# EAGLE design grbl_pendant (EAGLE 6.6.0)

## Sheet 1 of 2
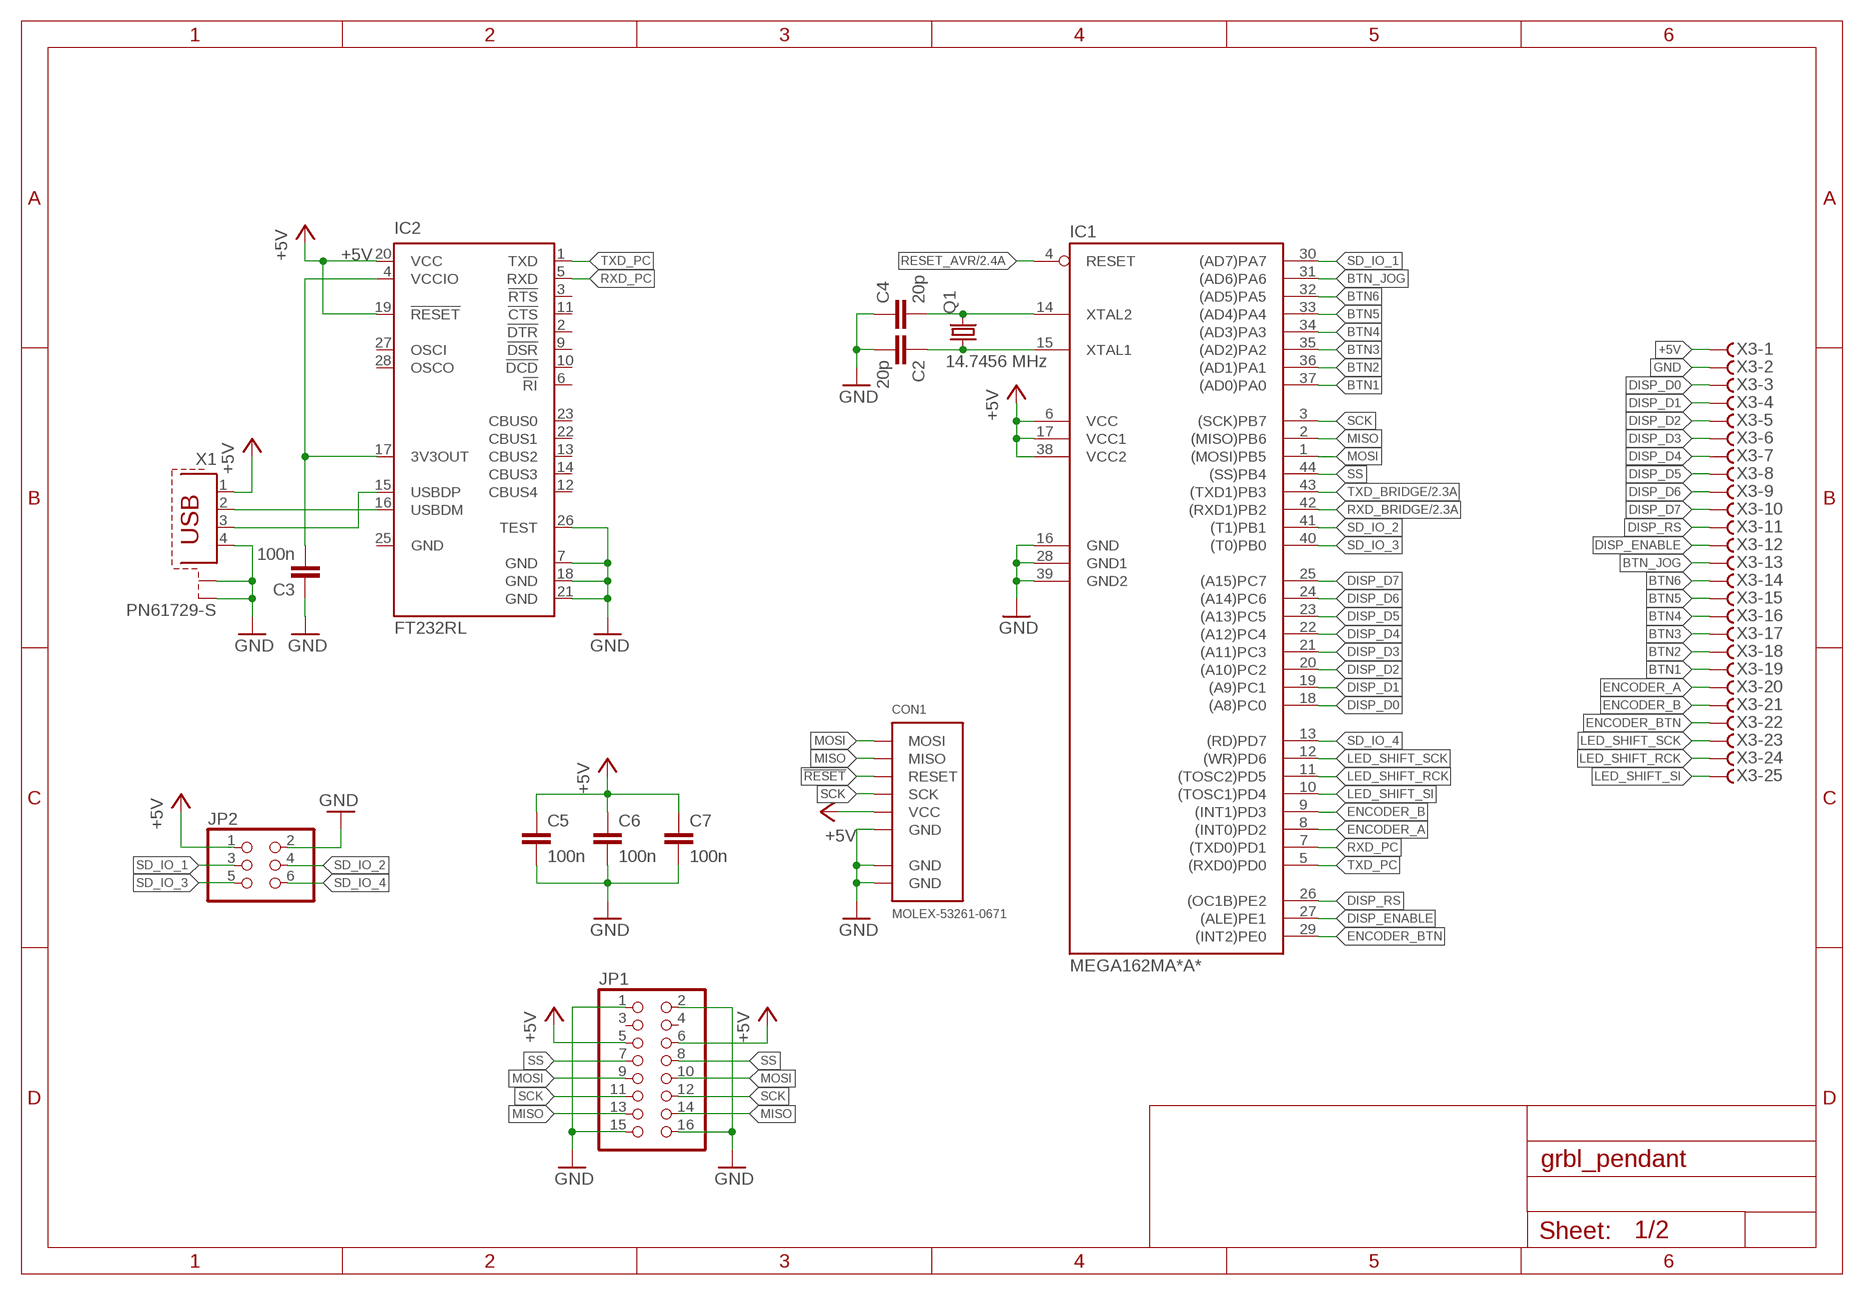
[diagram p0: schematic, sheet 1]

### Parts
C2  20p  C-EUC0603K  [C0603K]
C3  100n  C-EUC0603  [C0603]
C4  20p  C-EUC0603K  [C0603K]
C5  100n  C-EUC0603K  [C0603K]
C6  100n  C-EUC0603K  [C0603K]
C7  100n  C-EUC0603K  [C0603K]
CON1  MOLEX-53261-0671  [MOLEX-53261-0671]
IC1  MEGA162MA*A*  [TQFP44]
IC2  FT232RL  [SSOP28]
JP1  PINHD-2X08_2.54  [2X08]
JP2  PINHD-2X03_2.54  [2X03]
Q1  14.7456 MHz  CRYSTALHC49UP  [HC49UP]
X1  PN61729-S  [PN61729-S]
X3  F25HPS  [F25HP]

### Nets
!RESET: CON1.3(RESET)
+5V: C5.1 C6.1 C7.1 CON1.5(VCC) IC1.6(VCC) IC1.17(VCC1) IC1.38(VCC2) IC2.19(!RESET) IC2.20(VCC) JP1.5 JP1.6 JP2.1 X1.1 X3.1 ; also sheet 2
BTN1: IC1.37((AD0)PA0) X3.19
BTN2: IC1.36((AD1)PA1) X3.18
BTN3: IC1.35((AD2)PA2) X3.17
BTN4: IC1.34((AD3)PA3) X3.16
BTN5: IC1.33((AD4)PA4) X3.15
BTN6: IC1.32((AD5)PA5) X3.14
BTN_JOG: IC1.31((AD6)PA6) X3.13
DISP_D0: IC1.18((A8)PC0) X3.3
DISP_D1: IC1.19((A9)PC1) X3.4
DISP_D2: IC1.20((A10)PC2) X3.5
DISP_D3: IC1.21((A11)PC3) X3.6
DISP_D4: IC1.22((A12)PC4) X3.7
DISP_D5: IC1.23((A13)PC5) X3.8
DISP_D6: IC1.24((A14)PC6) X3.9
DISP_D7: IC1.25((A15)PC7) X3.10
DISP_ENABLE: IC1.27((ALE)PE1) X3.12
DISP_RS: IC1.26((OC1B)PE2) X3.11
ENCODER_A: IC1.8((INT0)PD2) X3.20
ENCODER_B: IC1.9((INT1)PD3) X3.21
ENCODER_BTN: IC1.29((INT2)PE0) X3.22
GND: C2.2 C3.1 C4.1 C5.2 C6.2 C7.2 CON1.6(GND) CON1.GND@1(GND) CON1.GND@2(GND) IC1.16(GND) IC1.28(GND1) IC1.39(GND2) IC2.7(GND) IC2.18(GND) IC2.21(GND) IC2.26(TEST) JP1.1 JP1.2 JP1.15 JP1.16 JP2.2 X1.4 X1.S1 X1.S2 X3.2 ; also sheet 2
LED_SHIFT_RCK: IC1.11((TOSC2)PD5) X3.24
LED_SHIFT_SCK: IC1.12((WR)PD6) X3.23
LED_SHIFT_SI: IC1.10((TOSC1)PD4) X3.25
MISO: CON1.2(MISO) IC1.2((MISO)PB6) JP1.13 JP1.14
MOSI: CON1.1(MOSI) IC1.1((MOSI)PB5) JP1.9 JP1.10
N$5: C3.2 IC2.4(VCCIO) IC2.17(3V3OUT)
N$7: C4.2 IC1.14(XTAL2) Q1.2
N$8: C2.1 IC1.15(XTAL1) Q1.1
RESET_AVR: IC1.4(RESET) ; also sheet 2
RXD_BRIDGE: IC1.42((RXD1)PB2) ; also sheet 2
RXD_PC: IC1.7((TXD0)PD1) IC2.5(RXD)
SCK: CON1.4(SCK) IC1.3((SCK)PB7) JP1.11 JP1.12
SD_IO_1: IC1.30((AD7)PA7) JP2.3
SD_IO_2: IC1.41((T1)PB1) JP2.4
SD_IO_3: IC1.40((T0)PB0) JP2.5
SD_IO_4: IC1.13((RD)PD7) JP2.6
SS: IC1.44((SS)PB4) JP1.7 JP1.8
TXD_BRIDGE: IC1.43((TXD1)PB3) ; also sheet 2
TXD_PC: IC1.5((RXD0)PD0) IC2.1(TXD)
USBDM: IC2.16(USBDM) X1.2
USBDP: IC2.15(USBDP) X1.3
Unconnected: IC2.2(!DTR) IC2.3(!RTS) IC2.6(!RI) IC2.9(!DSR) IC2.10(!DCD) IC2.11(!CTS) IC2.12(CBUS4) IC2.13(CBUS2) IC2.14(CBUS3) IC2.22(CBUS1) IC2.23(CBUS0) IC2.27(OSCI) IC2.28(OSCO) JP1.3 JP1.4

## Sheet 2 of 2
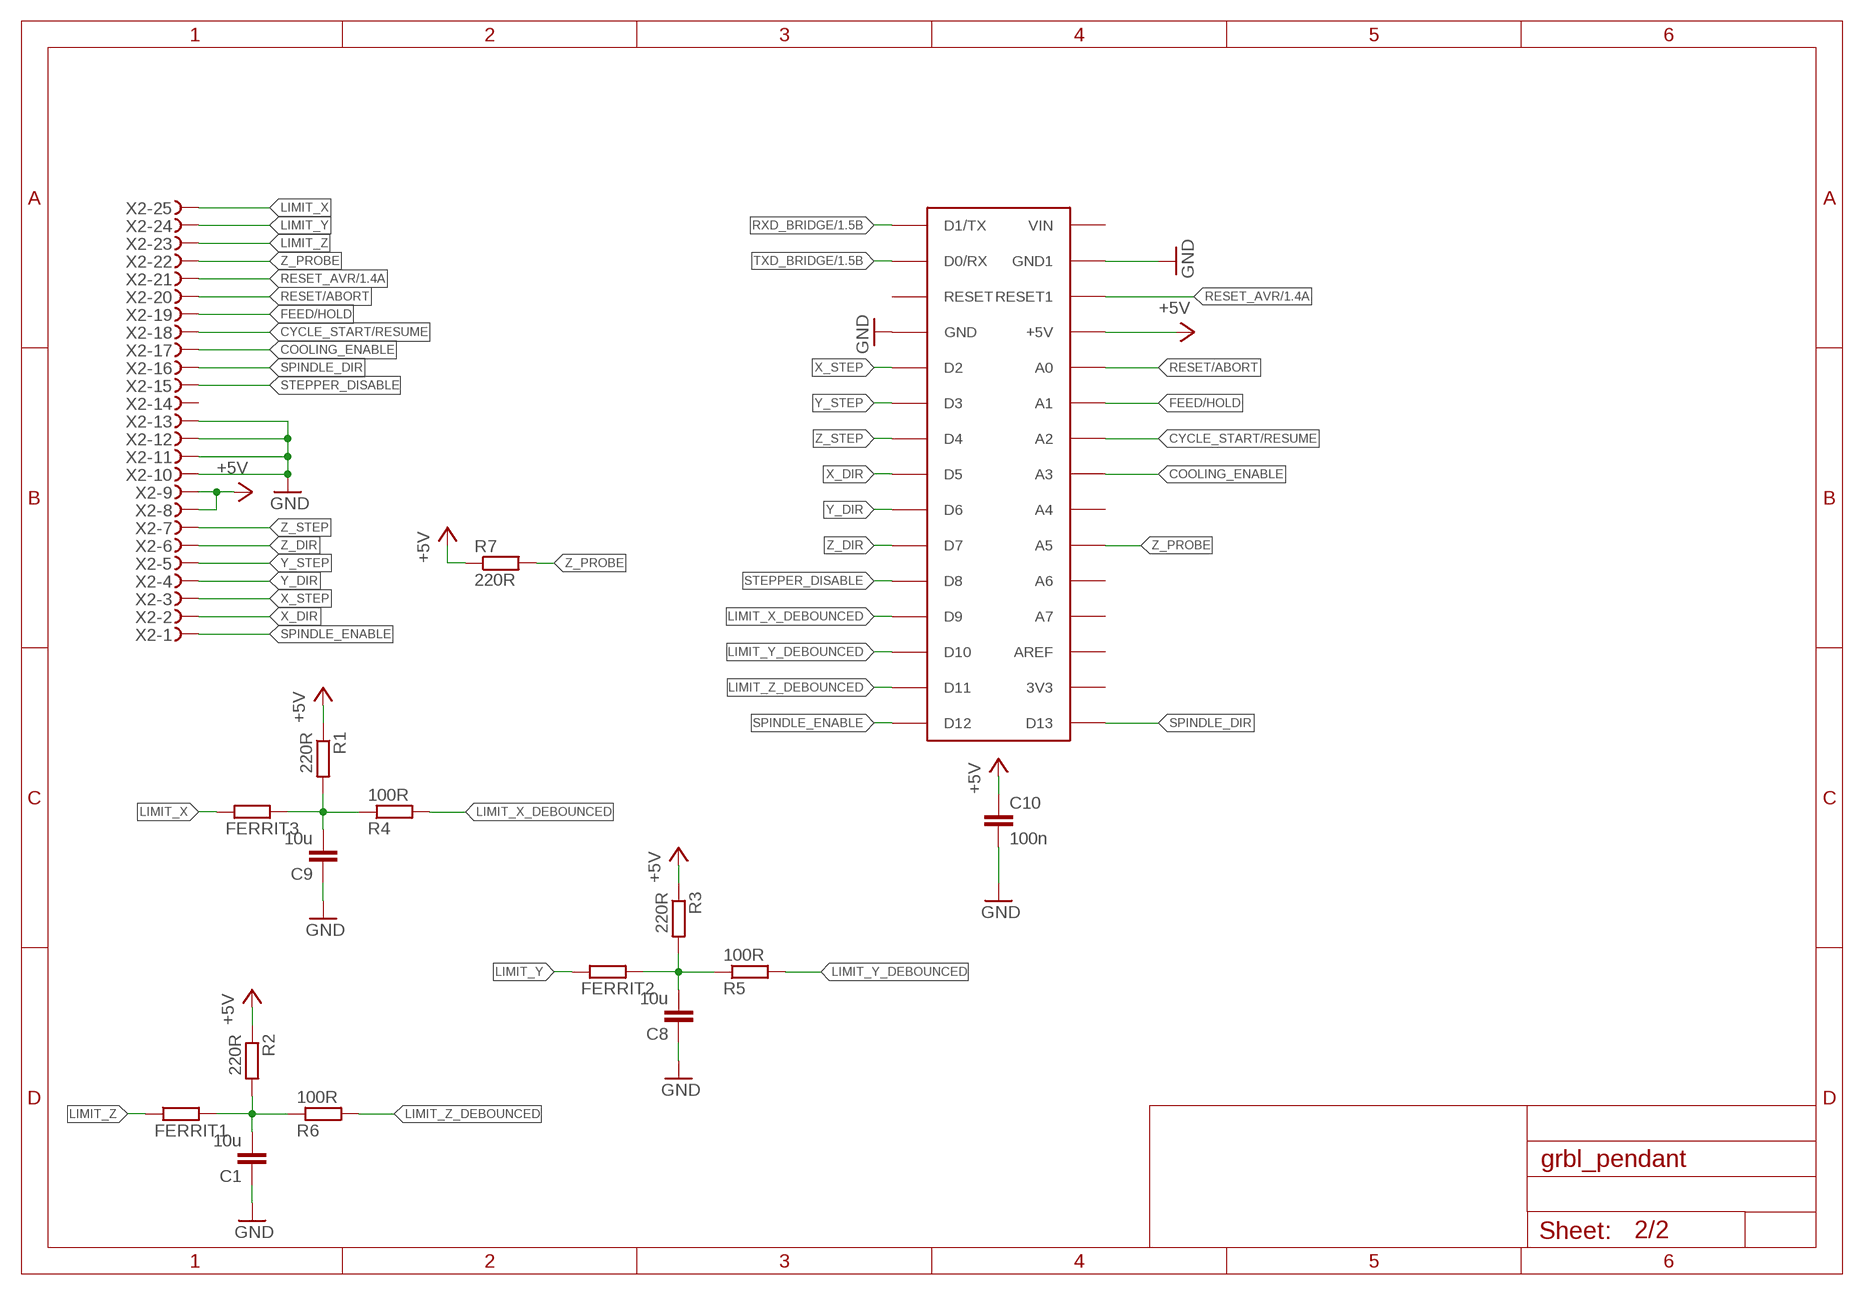
[diagram p1: schematic, sheet 2]

### Parts
C1  10u  C-EUC0805  [C0805]
C8  10u  C-EUC0805  [C0805]
C9  10u  C-EUC0805  [C0805]
C10  100n  C-EUC0805  [C0805]
FERRIT1  R-EU_M0805  [M0805]
FERRIT2  R-EU_M0805  [M0805]
FERRIT3  R-EU_M0805  [M0805]
R1  220R  R-EU_R0603  [R0603]
R2  220R  R-EU_R0603  [R0603]
R3  220R  R-EU_R0603  [R0603]
R4  100R  R-EU_R0603  [R0603]
R5  100R  R-EU_R0603  [R0603]
R6  100R  R-EU_R0603  [R0603]
R7  220R  R-EU_R0603  [R0603]
U$2  ARDUINONANO  [PDIP-32]
X2  F25HPS  [F25HP]

### Nets
+5V: C10.1 R1.1 R2.1 R3.1 R7.1 U$2.+5V X2.8 X2.9 ; also sheet 1
COOLING_ENABLE: U$2.A3 X2.17
CYCLE_START/RESUME: U$2.A2 X2.18
FEED/HOLD: U$2.A1 X2.19
GND: C1.1 C8.1 C9.1 C10.2 U$2.GND U$2.GND1 X2.10 X2.11 X2.12 X2.13 ; also sheet 1
LIMIT_INT_X: C9.2 FERRIT3.2 R1.2 R4.1
LIMIT_INT_Y: C8.2 FERRIT2.2 R3.2 R5.1
LIMIT_INT_Z: C1.2 FERRIT1.2 R2.2 R6.1
LIMIT_X: FERRIT3.1 X2.25
LIMIT_X_DEBOUNCED: R4.2 U$2.D9
LIMIT_Y: FERRIT2.1 X2.24
LIMIT_Y_DEBOUNCED: R5.2 U$2.D10
LIMIT_Z: FERRIT1.1 X2.23
LIMIT_Z_DEBOUNCED: R6.2 U$2.D11
RESET/ABORT: U$2.A0 X2.20
RESET_AVR: U$2.RESET1 X2.21 ; also sheet 1
RXD_BRIDGE: U$2.D1/TX ; also sheet 1
SPINDLE_DIR: U$2.D13 X2.16
SPINDLE_ENABLE: U$2.D12 X2.1
STEPPER_DISABLE: U$2.D8 X2.15
TXD_BRIDGE: U$2.D0/RX ; also sheet 1
X_DIR: U$2.D5 X2.2
X_STEP: U$2.D2 X2.3
Y_DIR: U$2.D6 X2.4
Y_STEP: U$2.D3 X2.5
Z_DIR: U$2.D7 X2.6
Z_PROBE: R7.2 U$2.A5 X2.22
Z_STEP: U$2.D4 X2.7
Unconnected: U$2.3V3 U$2.A4 U$2.A6 U$2.A7 U$2.AREF U$2.RESET U$2.VIN X2.14

## Power pins joined to a net without a drawn wire
GND: IC2.25(GND)

## Library data of the parts
C1-C10 = rcl:C-EU: CAPACITOR, European symbol
CON1 = SchlegelAr_Master:MOLEX-53261-0671: MOLEX-53261-0671 - Molex picoblade 53261-0671 6 pol last modified: Armin Schlegel, 28.04.2014 http://de.mouser.com/ProductDetail/Molex/53261-0671/?qs=%2Fha2pyFadujL8XqTNrjzA%2Fy0AZso5hx2IWE7X8dEAdsn1tpb%2FKahAA%3D%3D http://www.mouser.com/ds/2/276/0532610671_PCB_HEADERS-170915.pdf
FERRIT1-FERRIT3 R1-R7 = rcl:R-EU_: RESISTOR, European symbol
IC1 = avr-7:MEGA162*MA: Atmel Mega162 TQFP and MLF packages
IC2 = ftdichip:FT232R: Source: http://www.ftdichip.com/Documents/DataSheets/DS_FT232R_v104.pdf; MPN: FT232RL; OC_FARNELL: 1146032; OC_NEWARK: 91K9918
JP1 = pinhead-2:PINHD-2X08: PIN HEADER
JP2 = pinhead-2:PINHD-2X03: PIN HEADER
Q1 = crystal:CRYSTAL: CRYSTAL; OC_FARNELL: unknown; OC_NEWARK: unknown
U$2 = rocketfarm:ARDUINONANO
X1 = con-berg:PN61729-S: BERG USB connector; OC_FARNELL: unknown; OC_NEWARK: unknown
X2 X3 = con-subd:F25?S: SUB-D; OC_FARNELL: unknown; OC_NEWARK: unknown

## Board
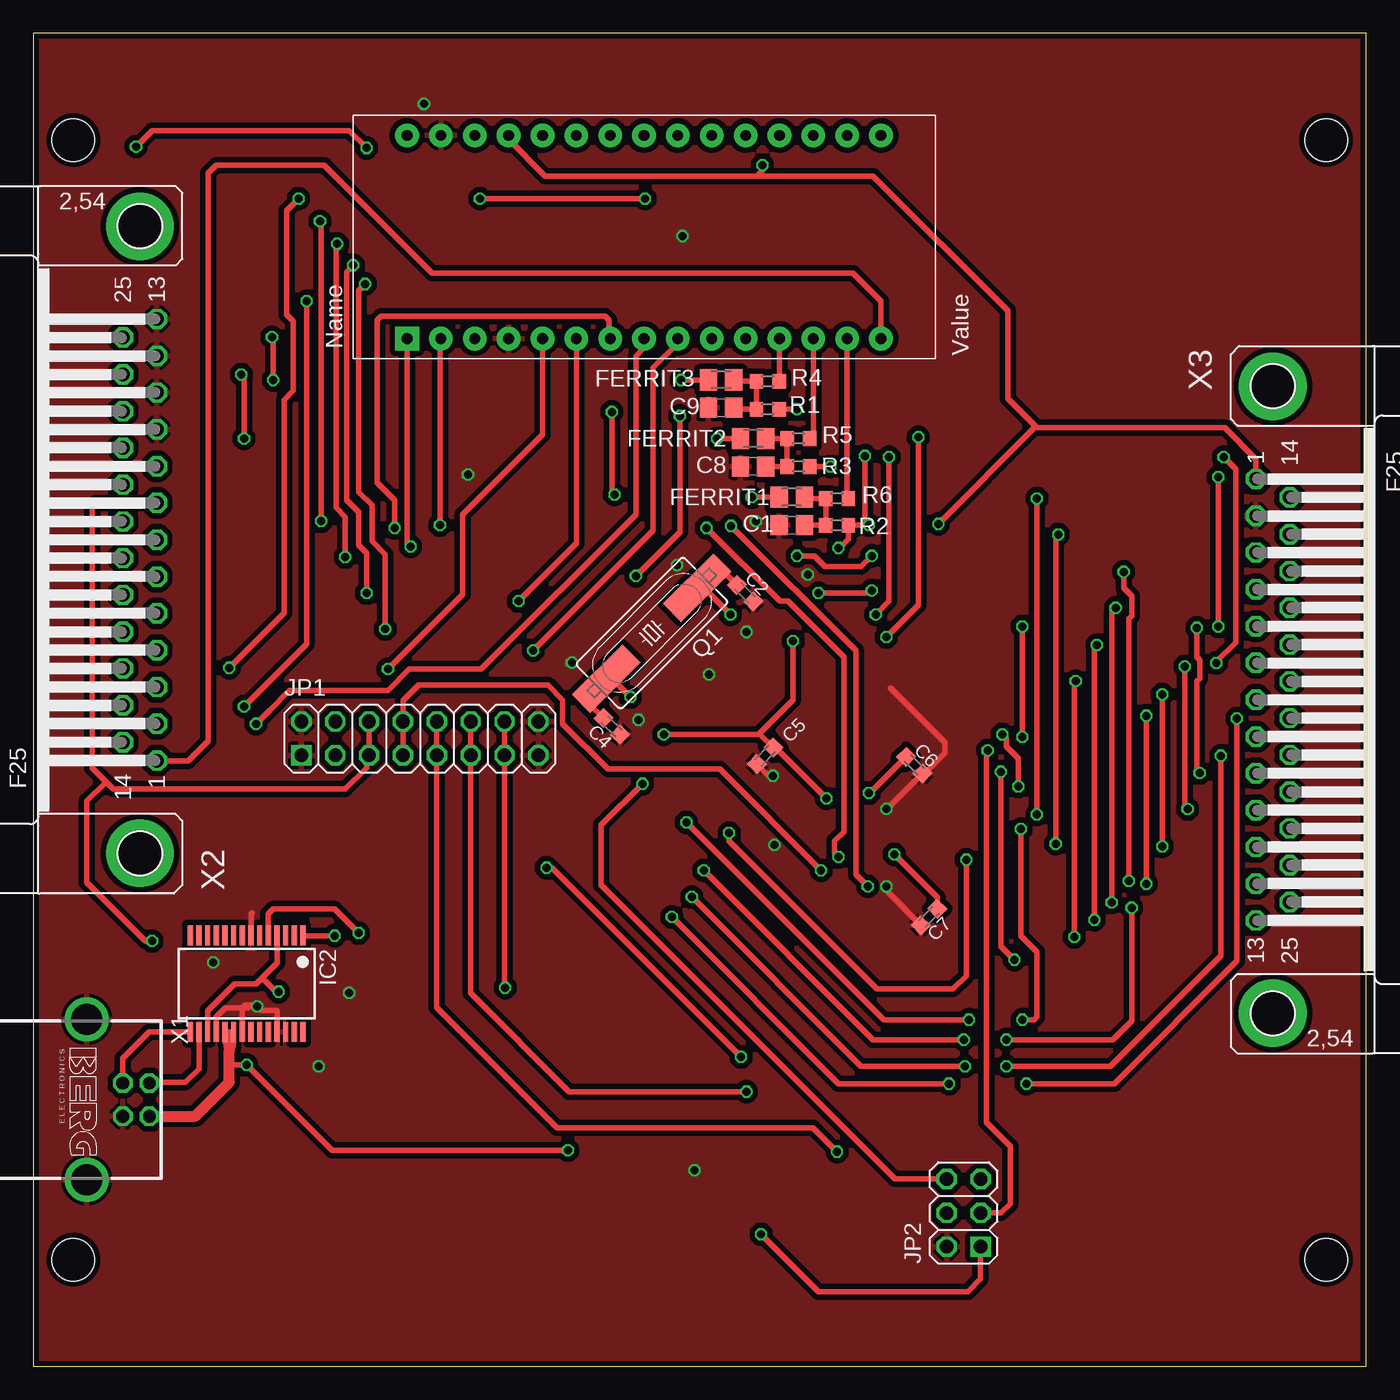
[diagram p2: board, top side]
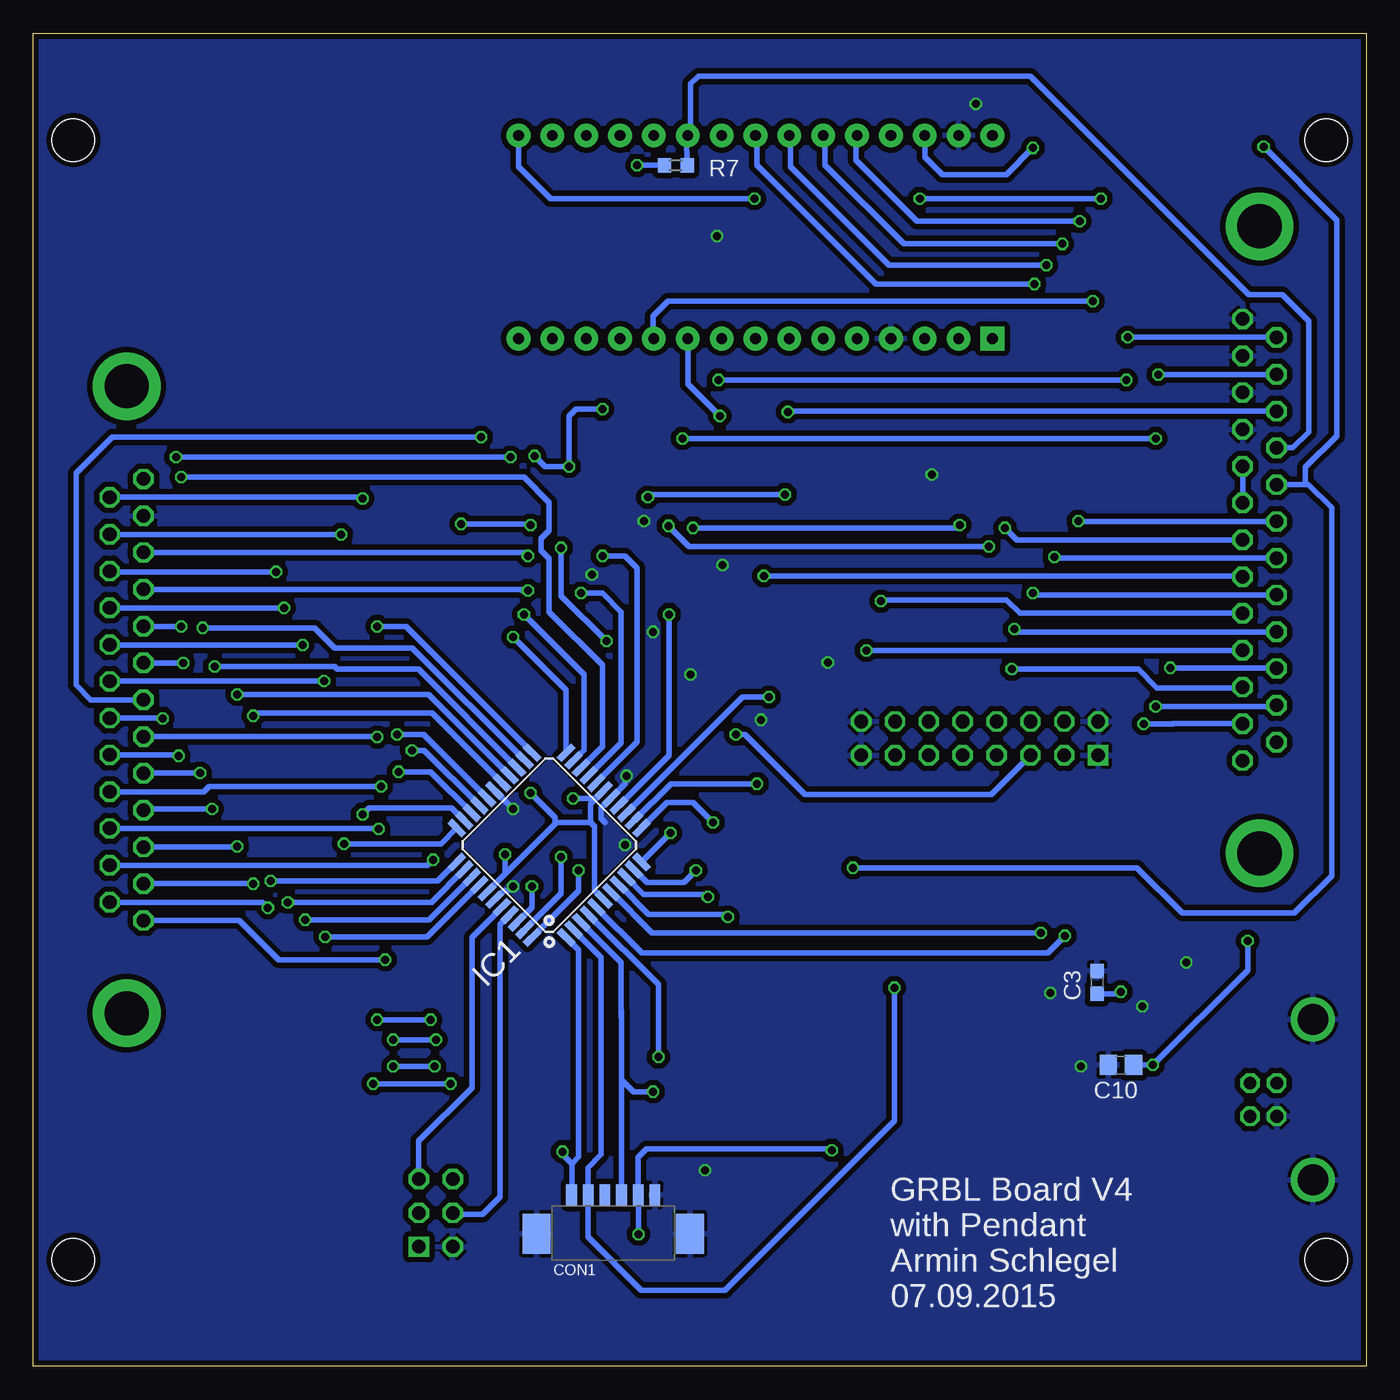
[diagram p3: board, bottom side, seen from below]

Size 100 x 100 mm. Coordinates in mm from the lower left corner, seen from the top.
Outline: 0,0 100,0 100,100 0,100 0,0
Copper layers (1*16): Top 0.035mm / dielectric 1.5mm / Bottom 0.035mm
Design rules "Elecrow_2-layer_eagle_rule": minimum track width 6mil, minimum drill 12mil, track to track 6mil, track to pad 6mil, pad to pad 6mil, via to via 6mil, smd to smd 0mil, copper to edge 10mil, drill to drill 10mil, minimum pad ring 10mil, minimum via ring 6mil, stop-mask expansion 2mil, vias tented up to drill 100mil, thermal gap 10mil
Holes 3.2 mm at 3,92 3,8 97,8 97,92

### Footprints (pad centres in the part's own frame; a part is rotated, then mirrored left to right if it is on the bottom)
C0805 = smd 1.3 x 1.5: 1 -0.95,0; 2 0.95,0
C0603K = smd 1.05 x 1.08: 1 -0.875,0; 2 0.875,0
C0603 = smd 1.1 x 1: 1 -0.85,0; 2 0.85,0
MOLEX-53261-0671 = smd 0.8 x 1.6: 1 -3.125,2.55; 2 -1.875,2.55; 3 -0.625,2.55; 4 0.625,2.55; 5 1.875,2.55; 6 3.125,2.55 | smd 2.1 x 3: GND@1 -5.75,-0.35; GND@2 5.75,-0.35
M0805 = smd 1.3 x 1.6: 1 -0.95,0; 2 0.95,0
TQFP44 = smd 1.5 x 0.5: 1 -5.8,4; 2 -5.8,3.2; 3 -5.8,2.4; 4 -5.8,1.6; 5 -5.8,0.8; 6 -5.8,0; 7 -5.8,-0.8; 8 -5.8,-1.6; 9 -5.8,-2.4; 10 -5.8,-3.2; 11 -5.8,-4; 23 5.8,-4; 24 5.8,-3.2; 25 5.8,-2.4; 26 5.8,-1.6; 27 5.8,-0.8; 28 5.8,0; 29 5.8,0.8; 30 5.8,1.6; 31 5.8,2.4; 32 5.8,3.2; 33 5.8,4 | smd 0.5 x 1.5: 12 -4,-5.8; 13 -3.2,-5.8; 14 -2.4,-5.8; 15 -1.6,-5.8; 16 -0.8,-5.8; 17 0,-5.8; 18 0.8,-5.8; 19 1.6,-5.8; 20 2.4,-5.8; 21 3.2,-5.8; 22 4,-5.8; 34 4,5.8; 35 3.2,5.8; 36 2.4,5.8; 37 1.6,5.8; 38 0.8,5.8; 39 0,5.8; 40 -0.8,5.8; 41 -1.6,5.8; 42 -2.4,5.8; 43 -3.2,5.8; 44 -4,5.8
SSOP28 = smd 0.4 x 1.5: 1 -4.225,-3.625; 2 -3.575,-3.625; 3 -2.925,-3.625; 4 -2.275,-3.625; 5 -1.625,-3.625; 6 -0.975,-3.625; 7 -0.325,-3.625; 8 0.325,-3.625; 9 0.975,-3.625; 10 1.625,-3.625; 11 2.275,-3.625; 12 2.925,-3.625; 13 3.575,-3.625; 14 4.225,-3.625; 15 4.225,3.625; 16 3.575,3.625; 17 2.925,3.625; 18 2.275,3.625; 19 1.625,3.625; 20 0.975,3.625; 21 0.325,3.625; 22 -0.325,3.625; 23 -0.975,3.625; 24 -1.625,3.625; 25 -2.275,3.625; 26 -2.925,3.625; 27 -3.575,3.625; 28 -4.225,3.625
2X08 = drill 1.016 square: 1 -8.89,-1.27 | drill 1.016 octagon: 2 -8.89,1.27; 3 -6.35,-1.27; 4 -6.35,1.27; 5 -3.81,-1.27; 6 -3.81,1.27; 7 -1.27,-1.27; 8 -1.27,1.27; 9 1.27,-1.27; 10 1.27,1.27; 11 3.81,-1.27; 12 3.81,1.27; 13 6.35,-1.27; 14 6.35,1.27; 15 8.89,-1.27; 16 8.89,1.27
2X03 = drill 1.016 square: 1 -2.54,-1.27 | drill 1.016 octagon: 2 -2.54,1.27; 3 0,-1.27; 4 0,1.27; 5 2.54,-1.27; 6 2.54,1.27
HC49UP = smd 5.334 x 1.93: 1 -4.826,0; 2 4.826,0
R0603 = smd 1 x 1.1: 1 -0.85,0; 2 0.85,0
PDIP-32 = drill 0.8 pad 1.778: 3V3 15.24,-35.56; +5V 15.24,-10.16; A0 15.24,-12.7; A1 15.24,-15.24; A2 15.24,-17.78; A3 15.24,-20.32; A4 15.24,-22.86; A5 15.24,-25.4; A6 15.24,-27.94; A7 15.24,-30.48; AREF 15.24,-33.02; D0/RX 0,-5.08; D2 0,-12.7; D3 0,-15.24; D4 0,-17.78; D5 0,-20.32; D6 0,-22.86; D7 0,-25.4; D8 0,-27.94; D9 0,-30.48; D10 0,-33.02; D11 0,-35.56; D12 0,-38.1; D13 15.24,-38.1; GND 0,-10.16; GND1 15.24,-5.08; RESET 0,-7.62; RESET1 15.24,-7.62; VIN 15.24,-2.54 | drill 0.8 pad 1.778 square: D1/TX 0,-2.54
PN61729-S = drill 0.95 octagon: 1 1.25,4.71; 2 -1.25,4.71; 3 -1.25,2.71; 4 1.25,2.71 | drill 2.3 pad 2.9: S1 -6.02,0; S2 6.02,0
F25HP = drill 1.016 octagon: 1 -16.561,-1.27; 2 -13.792,-1.27; 3 -11.049,-1.27; 4 -8.28,-1.27; 5 -5.512,-1.27; 6 -2.769,-1.27; 7 0,-1.27; 8 2.769,-1.27; 9 5.512,-1.27; 10 8.28,-1.27; 11 11.049,-1.27; 12 13.792,-1.27; 13 16.561,-1.27; 14 -15.189,1.27; 15 -12.421,1.27; 16 -9.652,1.27; 17 -6.909,1.27; 18 -4.14,1.27; 19 -1.372,1.27; 20 1.372,1.27; 21 4.14,1.27; 22 6.909,1.27; 23 9.652,1.27; 24 12.421,1.27; 25 15.189,1.27 | drill 3.302 pad 5.08: G1 -23.52,0; G2 23.52,0

### Placement (x,y rotation side)
C1  56.9,63.1 0 top
C2  53.4,58 315 top
C3  20.2,28.8 270 bottom
C4  43.4,48 135 top
C5  54.9,45.8 225 top
C6  66.1,45.1 315 top
C7  67.2,33.7 225 top
C8  54,67.5 0 top
C9  51.6,71.9 0 top
C10  18.4,22.6 180 bottom
CON1  56.5,10.3 0 bottom
FERRIT1  56.9,65.2 0 top
FERRIT2  54,69.6 0 top
FERRIT3  51.6,74 0 top
IC1  61.3,39.1 135 bottom
IC2  16,28.7 180 top
JP1  29,47.1 0 top
JP2  69.8,11.5 90 top
Q1  46.4,55 225 top
R1  55.1,71.8 180 top
R2  60.3,63.1 180 top
R3  57.4,67.5 180 top
R4  55.1,73.9 0 top
R5  57.4,69.6 0 top
R6  60.3,65.1 0 top
R7  51.8,90.1 0 bottom
U$2  25.5,77.1 90 top
X1  4,20 270 top
X2  8,62 90 top
X3  93,50 270 top

### Tracks (layer width: path | path; a pad name or v marks a point on that pad's centre or on a via)
+5V  (via drill 0.6)
  Top 0.406: JP1.6 JP1.5 25,45.64 25,44.9 23.4,43.3 6,43.3 5.45,43.85 | 14.7,23.7 14.7,23.9 14.7,24 14.4,24.3 14.4,25.05 IC2.19 IC2.20 15.03,24.23 14.8,24 | 14.7,24.7 14.7,24.9 14.6,25 | 14.7,22.6 v16,22.6 22.4,16.2 v40.1,16.2 | X2.8 4.67,64.77 4.4,64.5 4.4,44.9 5.45,43.85 | v8.9,31.9 8.4,31.9 4,36.3 4,42.4 5.45,43.85 | JP2.1 71.07,6.57 70.1,5.6 58.9,5.6 v54.6,9.9 | v64.6,38.4 67.82,35.18 C7.1 | C6.1 62.76,43 v62.7,43 | v59.5,42.6 55.68,46.42 C5.1 54.54,47.4 54.4,47.4 | v47.3,47.4 54.4,47.4 | X3.1 91.73,68.07 89.4,70.4 75.3,70.4 | 75.3,70.4 75.1,70.4 v67.9,63.2 | R3.1 v59.8,67.5 | v62.4,68.3 62.4,63.4 v62.7,63.1 R2.1 61.15,62.05 60.5,61.4 v60.4,61.4 | R1.1 v57.3,71.8 | U$2.+5V 35.66,92.04 38.4,89.3 54.3,89.3 | v54.7,90.1 54.7,89.7 54.3,89.3 | v57,54.4 57,50 54.4,47.4 | 54.3,89.3 63,89.3 73.1,79.2 73.1,72.6 75.3,70.4
  Top 0.813: X1.1 12.15,18.75 14.7,21.3 14.7,22.6 14.7,23.7 | 14.8,24 14.7,23.9 14.7,24.7
  Bottom 0.406: C10.1 v16,22.6 8.9,29.7 v8.9,31.9 | X2.9 X2.8 | v54.6,9.9 54.6,12.82 CON1.5 54.62,15.68 54,16.3 40.2,16.3 v40.1,16.2 | IC1.6 57.9,35.7 57.9,40.5 58.2,40.8 | 58.2,40.8 58.2,42.2 IC1.17 57.8,42.6 v59.5,42.6 | 60.87,40.67 IC1.38 64.6,36.93 v64.6,38.4 | 60.87,40.67 60.73,40.8 58.2,40.8 | v62.7,43 60.87,41.17 60.87,40.67 | JP1.5 28.12,42.9 42.1,42.9 46.6,47.4 v47.3,47.4 | v67.9,63.2 62.8,63.2 v62.7,63.1 | v62.4,68.3 61.6,67.5 v59.8,67.5 59.8,71.3 59.3,71.8 v57.3,71.8 | R7.1 v54.7,90.1 | v57,54.4 60.4,57.8 v60.4,61.4
BTN1  (via drill 0.6)
  Top 0.406: v78.1,32.2 78.1,51.3 v78.2,51.4
  Bottom 0.406: IC1.37 70.46,32.2 v78.1,32.2 | v78.2,51.4 94.24,51.4 X3.19
BTN2  (via drill 0.6)
  Top 0.406: v79.6,33.5 79.6,53.9 v79.8,54.1
  Bottom 0.406: IC1.36 70.29,33.5 v79.6,33.5 | v79.8,54.1 94.23,54.1 X3.18
BTN3  (via drill 0.6)
  Top 0.406: v80.9,34.8 80.9,56.6 v81.2,56.9
  Bottom 0.406: IC1.35 70.12,34.8 v80.9,34.8 | v81.2,56.9 X3.17
BTN4  (via drill 0.6)
  Top 0.406: v82.2,36.4 82.2,56.1 82.4,56.3 82.4,57.8 81.8,58.4 v81.8,59.6
  Bottom 0.406: IC1.34 69.66,36.4 v82.2,36.4 | v81.8,59.6 94.22,59.6 X3.16
BTN5  (via drill 0.6)
  Top 0.406: v76.7,39.2 76.7,62.2 v76.9,62.4
  Bottom 0.406: IC1.33 69.4,39.2 v76.7,39.2 | v76.9,62.4 94.25,62.4 X3.15
BTN6  (via drill 0.6)
  Top 0.406: 75.2,65 v75.3,65.1 v75.3,41.4
  Bottom 0.406: 75.4,65.3 75.3,65.2 v75.3,65.1 75.39,65.19 X3.14 | IC1.32 68.62,41.9 74.8,41.9 v75.3,41.4
BTN_JOG  (via drill 0.6)
  Top 0.406: 73.5,30.6 v73.6,30.5 72.6,31.5 v72.6,44.6
  Bottom 0.406: v73.6,30.5 81.6,30.5 84.54,33.44 X3.13 | IC1.31 70.19,44.6 v72.6,44.6
COOLING_ENABLE  (via drill 0.6)
  Top 0.406: v26.4,55.3 26.4,60.9 25.4,61.9 25.4,64.6 24.4,65.6 24.4,80.7 v24.9,81.2
  Bottom 0.406: X2.17 26.19,55.09 v26.4,55.3 | v24.9,81.2 36.8,81.2 45.7,90.1 45.7,92.22 U$2.A3
CYCLE_START/RESUME  (via drill 0.6)
  Top 0.406: v25,58 25,61 24.4,61.6 24.4,64.1 23.5,65 23.5,82.1 v24,82.6
  Bottom 0.406: X2.18 24.86,57.86 v25,58 | v24,82.6 35.8,82.6 43.2,90 43.2,92.26 U$2.A2
DISP_D0  (via drill 0.6)
  Top 0.406: 62.95,60.85 v62.9,60.8 62.1,60 59.4,60 58.6,60.8 v57.3,60.8
  Bottom 0.406: IC1.18 54.7,46.83 54.7,59.9 55.6,60.8 v57.3,60.8 | X3.3 63.15,61.05 v62.9,60.8
DISP_D1  (via drill 0.6)
  Top 0.406: v58.9,58 62.7,58 v62.9,58.2
  Bottom 0.406: IC1.19 55.9,46.76 55.9,56.6 57.3,58 v58.9,58 | X3.4 63.4,58.28 | 63.4,58.28 62.98,58.28 v62.9,58.2 63.32,58.2 63.4,58.28
DISP_D2  (via drill 0.6)
  Top 0.406: v88.9,55.5 v88.9,66.7
  Bottom 0.406: IC1.20 57.3,46.49 57.3,52.6 61.3,56.6 61.3,60.6 61.9,61.2 61.9,62.1 61.3,62.7 61.3,64.8 63.2,66.7 v88.9,66.7 | X3.5 88.91,55.51 v88.9,55.5
DISP_D3  (via drill 0.6)
  Top 0.406: v88.77,52.77 88.77,52.87 90.2,54.3 90.2,67.3 v89.3,68.2 | v64.2,68.2 64.2,57.4 v63.2,56.4
  Bottom 0.406: IC1.21 58.7,46.23 58.7,51.9 v63.2,56.4 | X3.6 v88.77,52.77 | v89.3,68.2 v64.2,68.2
DISP_D4  (via drill 0.6)
  Top 0.406: v66.4,69.7 66.4,57.1 v64,54.7
  Bottom 0.406: X3.7 95.7,50 96.8,51.1 96.8,67 94.1,69.7 v66.4,69.7 | IC1.22 60.03,50.73 v64,54.7
DISP_D5  (via drill 0.6)
  Top 0.406: v74.2,47.2 v74.2,55.5
  Bottom 0.406: IC1.23 72.04,55.5 v74.2,55.5 | v74.2,47.2 74.23,47.23 X3.8
DISP_D6  (via drill 0.6)
  Top 0.406: v87.3,55.4 87.3,53.2 87.5,53 87.5,51.6 87.3,51.4 87.3,44.7 v87.5,44.5
  Bottom 0.406: IC1.24 71.58,53.9 77.4,53.9 78.9,55.4 v87.3,55.4 | v87.5,44.5 91.72,44.5 X3.9
DISP_D7  (via drill 0.6)
  Top 0.406: v86.4,52.5 86.4,42 v86.6,41.8
  Bottom 0.406: IC1.25 71.11,52.3 77.2,52.3 77.4,52.5 v86.4,52.5 | v86.6,41.8 91.65,41.8 X3.10
DISP_ENABLE  (via drill 0.6)
  Top 0.406: v83.5,36.2 v83.5,48.8
  Bottom 0.406: IC1.27 70.07,49 83.2,49 v83.5,48.8 | X3.12 83.41,36.21 v83.5,36.2
DISP_RS  (via drill 0.6)
  Top 0.406: v84.7,39 v84.7,50.4
  Bottom 0.406: IC1.26 70.34,50.4 v84.7,50.4 | X3.11 84.75,38.95 v84.7,39
ENCODER_A  (via drill 0.6)
  Top 0.406: v90.3,48.6 90.3,30.4 81.1,21.2 v74.5,21.2 | v68.7,21.2 60.4,21.2 v47.9,33.7
  Bottom 0.406: IC1.8 53.84,33.9 48.1,33.9 v47.9,33.7 48,33.8 | X3.20 90.33,48.63 v90.3,48.6 | v74.5,21.2 v68.7,21.2
ENCODER_B  (via drill 0.6)
  Top 0.406: v89.1,45.8 89.1,30.8 80.8,22.5 v73,22.5 | v69.9,22.5 62.1,22.5 v49.4,35.2
  Bottom 0.406: IC1.9 54.21,35.4 49.6,35.4 v49.4,35.2 | X3.21 89.16,45.86 v89.1,45.8 | v73,22.5 v69.9,22.5
ENCODER_BTN  (via drill 0.6)
  Top 0.406: v72.7,47.4 73,47.1 73,46.5 73.9,45.6 v73.9,43.5
  Bottom 0.406: IC1.29 70.73,47.4 v72.7,47.4 | v73.9,43.5 86.8,43.5 87.2,43.1 X3.22
FEED/HOLD  (via drill 0.6)
  Top 0.406: v23.4,60.7 23.4,63.7 22.7,64.4 22.7,84.1 v22.8,84.2
  Bottom 0.406: X2.19 23.33,60.63 v23.4,60.7 | v22.8,84.2 34.7,84.2 40.6,90.1 40.6,92.2 U$2.A1
GND  (via drill 0.6)
  Top 0.406: IC2.7 16.32,33.92 16.4,34 | IC2.21 15.68,26.88 15.9,27.1 16.3,27.1 | 16.3,27.1 16.7,27.1 v16.8,27 17.1,26.7 18.2,26.7 18.27,26.62 IC2.25 | IC2.18 13.72,26.23 14.4,26.9 16.1,26.9 16.3,27.1 | v64,36 64.1,35.56 C7.2 | v55.5,44.3 55.16,44.3 C5.2 | v64,41.8 64.04,41.8 C6.2 66.88,44.48 68.4,46 68.4,46.8 64.3,50.9
  Bottom 0.406: v55.5,44.3 55.6,44.2 55.6,43.7 56.63,42.67 IC1.16 56.66,42.64 57.4,41.9 57.4,41.1 57.1,40.8 | IC1.28 | IC1.28 v64,41.8 | IC1.39 64.7,35.7 64.3,35.7 v64,36
  other vias: 23.7,28 13.5,30.3 21.4,22.5 49.6,14.7 58.1,59.4 54.2,63.4 32.6,66.9 48.7,84.8 29.3,94.7 50.7,51.9 55.6,39.1 40.4,52.8 48.3,60.1 53.5,55.1 45.4,48.5
  pour Top (isolate 0.406): 0,100 100,100 100,0 0,0
  pour Bottom (isolate 0.406): 0,100 99.9,100 99.9,0 0,0
LED_SHIFT_RCK  (via drill 0.6)
  Top 0.406: v70,38 70,29.3 69,28.3 63.3,28.3 52.2,39.4 v52.2,40
  Bottom 0.406: IC1.11 v52.2,40 | v70,38 70.4,37.6 70.4,37.58 X3.24
LED_SHIFT_SCK  (via drill 0.6)
  Top 0.406: v74.1,40.3 74.1,32.3 75.3,31.1 75.3,26.2 75.1,26 v74.2,26 | v70.2,26 63.8,26 v49,40.8
  Bottom 0.406: IC1.12 52.44,42.3 50.5,42.3 v49,40.8 | 74.2,40.4 v74.1,40.3 74.1,40.35 X3.23 | v74.2,26 v70.2,26
LED_SHIFT_SI  (via drill 0.6)
  Top 0.406: v82.4,34.4 82.4,25.9 81,24.5 v73,24.5 | v69.8,24.5 63,24.5 v50.3,37.2
  Bottom 0.406: IC1.10 53.98,36.3 51.2,36.3 v50.3,37.2 | X3.25 85.71,34.81 85.7,34.8 82.8,34.8 v82.4,34.4 | v73,24.5 v69.8,24.5
LIMIT_INT_X
  Top 0.406: FERRIT3.2 52.65,73.9 R4.1 R1.2 52.65,71.8 C9.2
LIMIT_INT_Y
  Top 0.406: C8.2 R3.2 R5.1 FERRIT2.2
LIMIT_INT_Z
  Top 0.406: C1.2 R2.2 R6.1 57.95,65.1 FERRIT1.2
LIMIT_X  (via drill 0.6)
  Top 0.406: FERRIT3.1 v48.6,74 | v18,74 18,77.1 v17.9,77.2
  Bottom 0.406: v48.6,74 v18,74 | v17.9,77.2 X2.25
LIMIT_X_DEBOUNCED
  Top 0.406: U$2.D9 55.98,73.93 R4.2
LIMIT_Y  (via drill 0.6)
  Top 0.406: FERRIT2.1 v51.3,69.6 | v15.8,69.6 15.8,74.2 v15.6,74.4
  Bottom 0.406: v51.3,69.6 v15.8,69.6 | v15.6,74.4 6.75,74.4 X2.24
LIMIT_Y_DEBOUNCED
  Top 0.406: U$2.D10 58.52,69.87 R5.2
LIMIT_Z  (via drill 0.6)
  Top 0.406: v43.4,71.6 43.4,65.6 v43.6,65.4 | v53.9,65.2 FERRIT1.1
  Bottom 0.406: X2.23 43.35,71.65 v43.4,71.6 | v43.6,65.4 53.7,65.4 v53.9,65.2
LIMIT_Z_DEBOUNCED
  Top 0.406: U$2.D11 61.06,65.19 R6.2
MISO  (via drill 0.6)
  Top 0.406: JP1.14 JP1.13 35.35,28.45 v35.4,28.4
  Bottom 0.406: IC1.2 57.4,30.68 57.4,15.9 58.4,14.9 58.4,12.88 CON1.2 58.4,12.82 58.4,9.7 54.4,5.7 48.1,5.7 35.4,18.4 v35.4,28.4
MOSI  (via drill 0.6)
  Top 0.406: JP1.10 JP1.9 30.27,26.93 39.3,17.9 58.5,17.9 v60.3,16.1
  Bottom 0.406: IC1.1 59.1,31.24 59.1,15.7 59.6,15.2 | 59.6,15.2 59.6,12.88 CON1.1 | v60.3,16.1 60.3,15.9 59.6,15.2
N$5  (via drill 0.6)
  Top 0.406: IC2.17 13.07,26.68 15.1,28.7 16.7,28.7 17.15,29.15 | IC2.4 18.27,30.27 17.15,29.15 | v18.4,28.1 18.2,28.1 17.15,29.15
  Bottom 0.406: C3.2 18.55,27.95 v18.4,28.1
N$7  (via drill 0.6)
  Top 0.406: C4.2 41.7,49.7 41.7,50.4 42.89,51.59 Q1.2 43.41,51.59 v44.8,50.2
  Bottom 0.406: IC1.14 46.81,50.2 v44.8,50.2
N$8  (via drill 0.6)
  Top 0.406: v52.3,56.4 50.29,58.41 Q1.1 51.1,59.7 51.7,59.7 C2.1
  Bottom 0.406: IC1.15 52.3,45.84 v52.3,56.4
RESET/ABORT  (via drill 0.6)
  Top 0.406: v21.6,63.4 21.6,85.8 v21.5,85.9
  Bottom 0.406: X2.20 21.57,63.37 v21.6,63.4 | v21.5,85.9 33.7,85.9 38.3,90.5 38.3,92.24 U$2.A0
RESET_AVR  (via drill 0.6)
  Top 0.406: 24.9,91.5 v25,91.4 23.7,92.7 8.9,92.7 v7.7,91.5 | v53.1,23.2 38.9,37.4 v38.5,37.4
  Bottom 0.406: IC1.4 53.1,28.64 v53.1,23.2 | 4.56,66.14 4.34,66.14 2.6,64.4 2.6,36.8 5.4,34 13.8,34 17.2,37.4 v38.5,37.4 | X2.21 4.56,66.14 | v25,91.4 27,89.4 31.8,89.4 33.1,90.7 33.1,92.32 U$2.RESET1 | 4.56,66.14 4.56,67.44 2.2,69.8 2.2,86 v7.7,91.5
RXD_BRIDGE  (via drill 0.6)
  Top 0.406: v62.6,36 61.7,36.9 61.7,53.7 v52.35,63.05 | U$2.D1/TX 28.04,61.76 v28.3,61.5
  Bottom 0.406: IC1.42 62.6,34.41 v62.6,36 | v28.3,61.5 50.8,61.5 v52.35,63.05
RXD_PC  (via drill 0.6)
  Top 0.406: IC2.5 17.62,33.92 18,34.3 22.6,34.3 v24.4,32.5
  Bottom 0.406: IC1.7 53.57,32.5 v24.4,32.5
SCK  (via drill 0.6)
  Top 0.406: JP1.12 JP1.11 32.81,27.99 40.2,20.6 v53.5,20.6
  Bottom 0.406: IC1.3 55.9,30.31 55.9,26.7 | 55.9,26.7 55.9,26.2 | CON1.4 55.88,21.5 | 55.88,21.5 55.88,26.68 55.9,26.7 | v53.5,20.6 54.98,20.6 55.88,21.5
SD_IO_1  (via drill 0.6)
  Top 0.406: v71.6,46.2 71.5,46.1 71.5,18.3 73.3,16.5 73.3,12.2 72.6,11.5 JP2.3
  Bottom 0.406: IC1.30 70.66,46.2 v71.6,46.2
SD_IO_2
  Bottom 0.406: JP2.4 68.43,11.4 66.3,11.4 65,12.7 65,33.14 IC1.41
SD_IO_3
  Bottom 0.406: JP2.5 71.1,14.07 71.1,16.9 67.1,20.9 67.1,32.17 IC1.40
SD_IO_4  (via drill 0.6)
  Top 0.406: JP2.6 64.66,14.04 42.6,36.1 42.6,40.6 v45.7,43.7
  Bottom 0.406: IC1.13 52.17,43.7 v45.7,43.7
SPINDLE_DIR  (via drill 0.6)
  Top 0.406: 19.7,87.4 v19.9,87.6 19,86.7 19,78.9 19.5,78.4 19.5,73.2 18.8,72.5 18.8,56.5 v14.7,52.4 | v33.5,87.6 v45.9,87.6
  Bottom 0.406: v19.9,87.6 v33.5,87.6 | v45.9,87.6 61.2,87.6 63.6,90 U$2.D13 | X2.16 6.78,52.4 v14.7,52.4
SPINDLE_ENABLE
  Top 0.406: X2.1 9.31,45.4 11.6,45.4 13.1,46.9 13.1,89.5 13.7,90.1 21.8,90.1 29.9,82 61.5,82 63.6,79.9 U$2.D12
SS  (via drill 0.6)
  Top 0.406: JP1.7 JP1.8 27.73,49.93 28.9,51.1 38.6,51.1 39.7,50 39.7,48.2 43.1,44.8 51.5,44.8 v59.1,37.2
  Bottom 0.406: IC1.44 59.1,35.64 v59.1,37.2
STEPPER_DISABLE  (via drill 0.6)
  Top 0.406: v15.8,49.5 20.5,54.2 v20.5,79.9
  Bottom 0.406: v20.5,79.9 52.4,79.9 53.5,78.8 53.5,77.16 U$2.D8 | X2.15 6.81,49.5 v15.8,49.5
TXD_BRIDGE  (via drill 0.6)
  Top 0.406: v60.4,38.2 60.1,38.5 60.1,39.4 60.8,40.1 60.8,53.2 56.6,57.4 56,57.4 v50.5,62.9 | v30.5,63.1 30.5,77.02 U$2.D0/RX
  Bottom 0.406: IC1.43 60.4,35.48 v60.4,38.2 | v50.5,62.9 30.7,62.9 v30.5,63.1
TXD_PC  (via drill 0.6)
  Top 0.406: v22.6,32.3 20.25,32.3 IC2.1
  Bottom 0.406: IC1.5 54.33,31 23.9,31 v22.6,32.3
USBDM
  Top 0.406: IC2.16 12.43,22.32 11.4,21.3 8.76,21.3 X1.2
USBDP
  Top 0.406: IC2.15 8.68,25.07 6.7,23.1 X1.3
X_DIR  (via drill 0.6)
  Top 0.406: U$2.D5 45.82,76.42 45.2,75.8 45.2,63.9 33.6,52.3 28.2,52.3 26.6,50.7 19.2,50.7 17.75,49.25 v16.7,48.2
  Bottom 0.406: X2.2 14.49,48.21 14.5,48.2 v16.7,48.2
X_STEP  (via drill 0.6)
  Top 0.406: v26.6,52.3 32.2,57.9 32.2,63.9 38.2,69.9 U$2.D2
  Bottom 0.406: X2.3 9.32,50.9 15.7,50.9 17.1,52.3 v26.6,52.3 26.4,52.1
Y_DIR  (via drill 0.6)
  Top 0.406: U$2.D6 48.36,76.76 46.5,74.9 46.5,62.7 v37.5,53.7
  Bottom 0.406: v37.5,53.7 9.29,53.7 X2.4
Y_STEP  (via drill 0.6)
  Top 0.406: v36.4,57.4 40.74,61.74 U$2.D3
  Bottom 0.406: X2.5 25.99,56.49 27,57.5 36.3,57.5 v36.4,57.4
Z_DIR  (via drill 0.6)
  Top 0.406: v48.5,71.3 48.5,62.6 v45.2,59.3
  Bottom 0.406: U$2.D7 50.9,73.7 v48.5,71.3 | v45.2,59.3 9.34,59.3 X2.6
Z_PROBE
  Bottom 0.406: R7.2 51,92.24 U$2.A5 50.7,92.54 50.7,96.2 50.1,96.8 25.2,96.8 8.8,80.4 6.3,80.4 4.3,78.4 4.3,70.1 5.49,68.91 X2.22
Z_STEP  (via drill 0.6)
  Top 0.406: v27.1,62.9 27.1,65 25.8,66.3 25.8,78.5 26.1,78.8 42.9,78.8 43.2,78.5 43.2,77.18 U$2.D4
  Bottom 0.406: X2.7 26.2,62 v27.1,62.9

### Text on the board
bNames: GRBL Board V4 / with Pendant / Armin Schlegel / 07.09.2015